# EAGLE schematic waterius-factory-2.0wago (EAGLE 9.0.1)
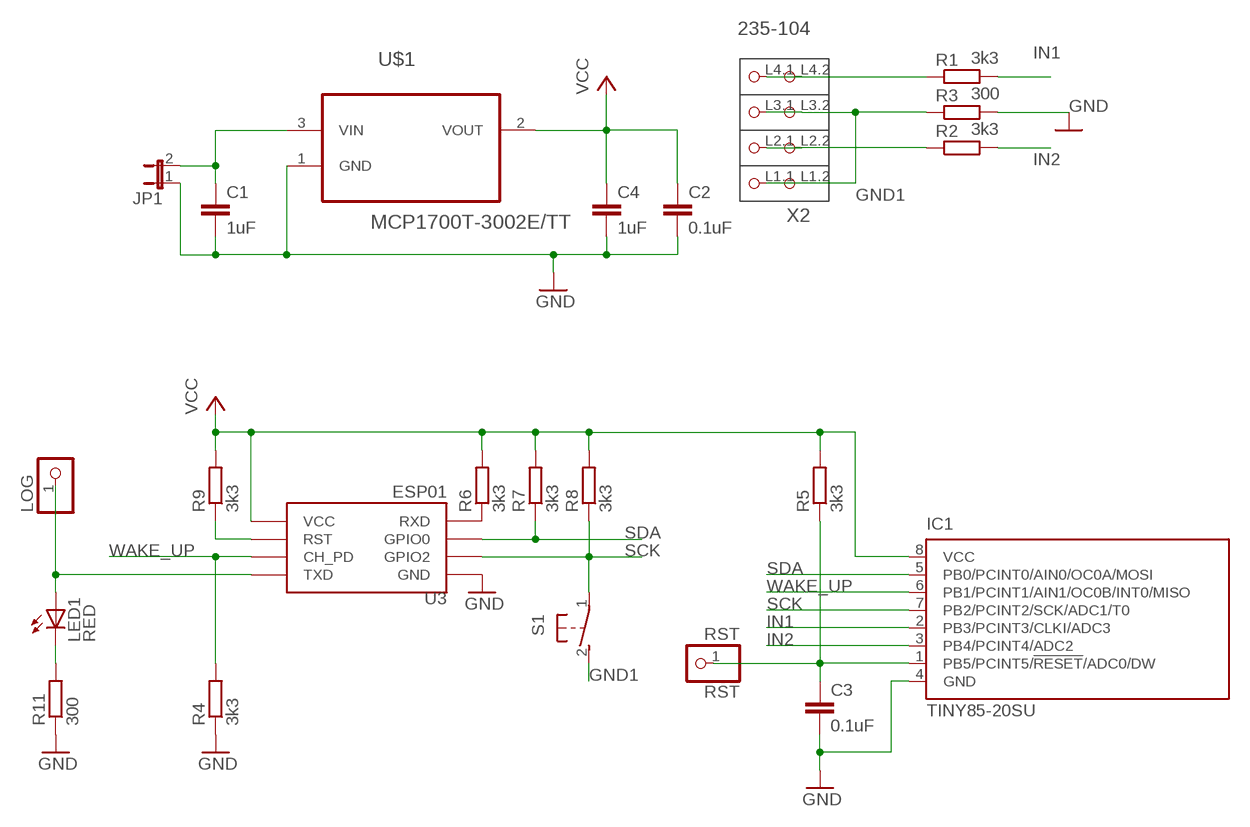
[diagram p0: schematic, sheet 1]

## Parts
C1  1uF  C-EUC0805  [C0805]
C2  0.1uF  C-EUC0805  [C0805]
C3  0.1uF  C-EUC0805  [C0805]
C4  1uF  C-EUC0805  [C0805]
IC1  TINY85-20SU  TINY13-20SU  [8S2]
JP1  JP1E  [JP1]
LED1  RED  LED3MM  [LED3MM]
LOG  PINHD-1X1  [1X01]
R1  3k3  R-EU_R0805  [R0805]
R2  3k3  R-EU_R0805  [R0805]
R3  300  R-EU_R0805  [R0805]
R4  3k3  R-EU_R0805  [R0805]
R5  3k3  R-EU_R0805  [R0805]
R6  3k3  R-EU_R0805  [R0805]
R7  3k3  R-EU_R0805  [R0805]
R8  3k3  R-EU_R0805  [R0805]
R9  3k3  R-EU_R0805  [R0805]
R11  300  R-EU_R0805  [R0805]
RST  RST  PINHD-1X1  [1X01]
S1  31-XX  [B3F-31XX]
U3  ESP01  [ESP01]
U$1  MCP1700T-3002E/TT  [SOT95P237X112-3N]
X2  235-104  [P-235-104]

## Nets
+3V: C2.1 C4.1 IC1.8(VCC) R5.2 R6.2 R7.2 R8.2 R9.2 U3.VCC U$1.2(VOUT) ; supply symbol labelled VCC
GND: C1.2 C2.2 C3.2 C4.2 IC1.4(GND) JP1.1 R3.2 R4.1 R11.1 U3.GND U$1.1(GND)
GND1: R3.1 S1.2(S) X2.L1.1(P1.1) X2.L1.2(P1.2) X2.L3.1(P3.1) X2.L3.2(P3.2)
IN1: IC1.2(PB3/PCINT3/CLKI/ADC3) R1.2
IN2: IC1.3(PB4/PCINT4/ADC2) R2.2
N$1: C1.1 JP1.2 U$1.3(VIN)
N$2: R6.1 U3.RX(RXD)
N$3: R9.1 U3.RST
N$4: C3.1 IC1.1(PB5/PCINT5/!RESET!/ADC0/DW) R5.1 RST.1
N$5: LED1.A LOG.1 U3.TX(TXD)
N$6: LED1.K(C) R11.2
N$8: R2.1 X2.L2.1(P2.1) X2.L2.2(P2.2)
N$10: R1.1 X2.L4.1(P4.1) X2.L4.2(P4.2)
SCK: IC1.7(PB2/PCINT2/SCK/ADC1/T0) R8.1 S1.1(P) U3.GPIO2
SDA: IC1.5(PB0/PCINT0/AIN0/OC0A/MOSI) R7.1 U3.GPIO0
WAKE_UP: IC1.6(PB1/PCINT1/AIN1/OC0B/INT0/MISO) R4.2 U3.CH_PD

## Library data of the parts
C1-C4 = rcl:C-EU: CAPACITOR, European symbol; SPICEPREFIX: C
IC1 = atmel:TINY13: 8-bit AVR Microcontroller with 1K Bytes In-System Programmable Flash Source: http://www.atmel.com/dyn/resources/prod_documents/2535S.pdf; MPN: ATTINY13-20SU; OC_FARNELL: 9171568; OC_NEWARK: 96K6522
JP1 = jumper:JP1E: JUMPER
LED1 = led:LED: LED OSRAM: - CHIPLED LG R971, LG N971, LY N971, LG Q971, LY Q971, LO R971, LY R971 LH N974, LH R974 LS Q976, LO Q976, LY Q976 LO Q996 - Hyper CHIPLED LW Q18S LB Q993, LB Q99A, LB R99A - SideLED LS A670, LO A670, LY A670, LG A670, LP A670 LB A673, LV A673, LT A673, LW A673 LH A674 LY A675 LS A676, LA A676, LO A676, LY A676, LW A676 LS A679, LY A679, LG A679 - Hyper Micro SIDELED® LS Y876, LA Y876, LO Y876, LY Y876 LT Y87S - SmartLED LW L88C, LW L88S LB L89C, LB L89S, LG L890 LS L89K, LO L89K, LY L89K LS L896, LA L896, LO L896, LY L896 - TOPLED LS T670, LO T670, LY T670, LG T670, LP T670 LSG T670, LSP T670, LSY T670, LOP T670, LYG T670 LG T671, LOG T671, LSG T671 LB T673, LV T673, LT T673, LW T673 LH T674 LS T676, LA T676, LO T676, LY T676, LB T676, LH T676, LSB T676, LW T676 LB T67C, LV T67C, LT T67C, LS T67K, LO T67K, LY T67K, LW E67C LS E67B, LA E67B, LO E67B, LY E67B, LB E67C, LV E67C, LT E67C LW T67C LS T679, LY T679, LG T679 LS T770, LO T770, LY T770, LG T770, LP T770 LB T773, LV T773, LT T773, LW T773 LH T774 LS E675, LA E675, LY E675, LS T675 LS T776, LA T776, LO T776, LY T776, LB T776 LHGB T686 LT T68C, LB T68C - Hyper Mini TOPLED® LB M676 - Mini TOPLED Santana® LG M470 LS M47K, LO M47K, LY M47K Source: http://www.osram.convergy.de LUXEON: - LUMILED® LXK2-PW12-R00, LXK2-PW12-S00, LXK2-PW14-U00, LXK2-PW14-V00 LXK2-PM12-R00, LXK2-PM12-S00, LXK2-PM14-U00 LXK2-PE12-Q00, LXK2-PE12-R00, LXK2-PE12-S00, LXK2-PE14-T00, LXK2-PE14-U00 LXK2-PB12-K00, LXK2-PB12-L00, LXK2-PB12-M00, LXK2-PB14-N00, LXK2-PB14-P00, LXK2-PB14-Q00 LXK2-PR12-L00, LXK2-PR12-M00, LXK2-PR14-Q00, LXK2-PR14-R00 LXK2-PD12-Q00, LXK2-PD12-R00, LXK2-PD12-S00 LXK2-PH12-R00, LXK2-PH12-S00 LXK2-PL12-P00, LXK2-PL12-Q00, LXK2-PL12-R00 Source: www.luxeon.com KINGBRIGHT: KA-3528ASYC Source: www.kingbright.com
LOG RST = pinhead:PINHD-1X1: PIN HEADER
R1-R9 R11 = resistor:R-EU_: RESISTOR, European symbol
S1 = switch-omron:31-XX: OMRON SWITCH; MPN: B3F-3100; OC_FARNELL: 959704; OC_NEWARK: 36M3582
U3 = esp8266modules:ESP01: ESP8266 Wifi module 01
U$1 = MCP1700T-3002E_TT:MCP1700T-3002E/TT: Low Quiescent Current LDO; AVAILABILITY: Unavailable; DESCRIPTION: MCP1700 Series 250 mA 3 V Fixed Output LDO Voltage Regulator - SOT-23; MF: Microchip; MP: MCP1700T-3002E/TT; PACKAGE: SOT-23 Microchip; PRICE: None
X2 = con-wago_235:235-104: Serie 235, 1-Leiter-Klemmenleiste für Leiterplatten 2 Lötstifte/Pol / Series 235, 1-conductor PCB terminal strip 2 solder pins/pole Polzahl / Pole No.: 4 Rastermaß / Pitch: 3.81 mm Bemessungsspannung / Rated Voltage: 320 V Nennstrom / Nominal Current: 17.5 A Leiterquerschnitt / Conductor Size: 0.5 - 1.5 mm² Anschlusstechnik / Connection Technology: Steckklemm-Anschluss Lötstiftlänge: / Solder Pin Length: 3.6 mm Leitereinführung (zur Platine) / Conductor entry angle (to PCB): 0 ° Farbe / Color: orange / orange Stand: 01.01.2012. Die jeweils aktuellen Daten zu diesem Artikel finden Sie in unserem Produktkatalog, den Sie unter www.wago.com einsehen können. As of: 01/01/2012. Please find the newest data for this article in our product catalogue, which can be viewed under www.wago.com.

## Net classes
0 default: clearance 0.205 mm